# Altium schematic sheet Microcontroller.SchDoc: Microcontroller
size A4; SheetNumber: 4; SheetTotal: 6
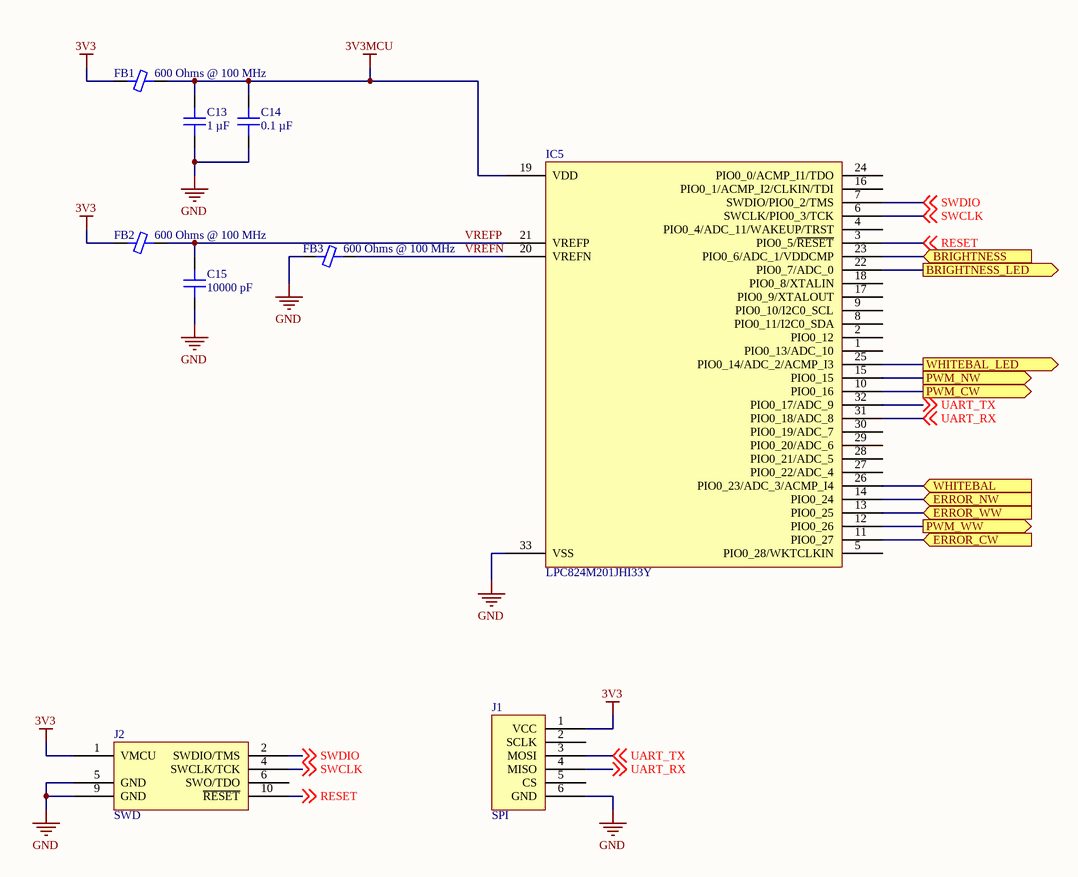
[diagram p0: Microcontroller.SchDoc]

## Parts
C13  1 µF  [CAP 0603_1608]
C14  0.1 µF  [CAP 0603_1608]
C15  10000 pF  [CAP 0603_1608]
FB1  600 Ohms @ 100 MHz  [FER 0603_1608]
FB2  600 Ohms @ 100 MHz  [FER 0603_1608]
FB3  600 Ohms @ 100 MHz  [FER 0603_1608]
IC5  LPC824M201JHI33Y  [NXP HVQFN-33 5X5MM]
J1  SPI  [SPI Breakout]
J2  SWD  [10 Pin SWD]  (no BOM)

## Ports
BRIGHTNESS (in), BRIGHTNESS_LED (out), ERROR_CW (in), ERROR_NW (in), ERROR_WW (in), PWM_CW (out), PWM_NW (out), PWM_WW (out), WHITEBAL (in), WHITEBAL_LED (out)

## Nets
3V3: FB1.1 FB2.1 J1.1(VCC) J2.1(VMCU)
3V3MCU: C13.2 C14.2 FB1.2 IC5.19(VDD)
GND: C13.1 C14.1 C15.1 FB3.1 IC5.33(VSS) J1.6(GND) J2.5(GND) J2.9(GND)
BRIGHTNESS: IC5.23(PIO0_6/ADC_1/VDDCMP) ; port BRIGHTNESS
BRIGHTNESS_LED: IC5.22(PIO0_7/ADC_0) ; port BRIGHTNESS_LED
ERROR_CW: IC5.11(PIO0_27) ; port ERROR_CW
ERROR_NW: IC5.14(PIO0_24) ; port ERROR_NW
ERROR_WW: IC5.13(PIO0_25) ; port ERROR_WW
PWM_CW: IC5.10(PIO0_16) ; port PWM_CW
PWM_NW: IC5.15(PIO0_15) ; port PWM_NW
PWM_WW: IC5.12(PIO0_26) ; port PWM_WW
RESET: IC5.3(PIO0_5/~{RESET}) J2.10(~{RESET}) ; off-sheet RESET
SWCLK: IC5.6(SWCLK/PIO0_3/TCK) J2.4(SWCLK/TCK) ; off-sheet SWCLK
SWDIO: IC5.7(SWDIO/PIO0_2/TMS) J2.2(SWDIO/TMS) ; off-sheet SWDIO
UART_RX: IC5.31(PIO0_18/ADC_8) J1.4(MISO) ; off-sheet UART_RX
UART_TX: IC5.32(PIO0_17/ADC_9) J1.3(MOSI) ; off-sheet UART_TX
VREFN: FB3.2 IC5.20(VREFN)
VREFP: C15.2 FB2.2 IC5.21(VREFP)
WHITEBAL: IC5.26(PIO0_23/ADC_3/ACMP_I4) ; port WHITEBAL
WHITEBAL_LED: IC5.25(PIO0_14/ADC_2/ACMP_I3) ; port WHITEBAL_LED

Not connected (* = marked no-connect by the designer): IC5 1(PIO0_13/ADC_10) 2(PIO0_12) 4(PIO0_4/ADC_11/WAKEUP/TRST) 5(PIO0_28/WKTCLKIN) 8(PIO0_11/I2C0_SDA) 9(PIO0_10/I2C0_SCL) 16(PIO0_1/ACMP_I2/CLKIN/TDI) 17(PIO0_9/XTALOUT) 18(PIO0_8/XTALIN) 24(PIO0_0/ACMP_I1/TDO) 27(PIO0_22/ADC_4) 28(PIO0_21/ADC_5) 29(PIO0_20/ADC_6) 30(PIO0_19/ADC_7); J1 2(SCLK) 5(CS); J2 6(SWO/TDO)

## Notes on the sheet
- Title
- Size:
- Date:
- A4
- Number:
- Time:
- Revision:
- Sheet
- of
- File:

## Library data of the parts
C13 = CC0603KRX7R6BB105: CAP CER 1UF 10V X7R 0603; manufacturer: Yageo; Tolerance: ±10%; Part Number: CC0603KRX7R6BB105; Value: 1 µF; Applications: General Purpose; Capacitance: 1 µF; componentlink1description: Datasheet; componentlink1url: https://www.yageo.com/upload/media/product/productsearch/datasheet/mlcc/UPY-GPHC_X7R_6.3V-to-50V_18.pdf; componentlink2description: DigiKey Link; componentlink2url: https://www.digikey.com/en/products/detail/yageo/CC0603KRX7R6BB105/5195204; Device Package: 0603 (1608 Metric); lastupdated: 16/03/2022 06:22:54; Lifecycle Status: Active; Minimum Order: 1; Mounting Type: Surface Mount, MLCC; Operating Temperature: -55°C ~ 125°C; Package / Case: 0603 (1608 Metric); packaging: TapeAndReel; partid: 2290; Part Status: Active; price: 0.02; series: CC; Size / Dimension: 0.063" L x 0.031" W (1.60mm x 0.80mm); Supplier 1: DigiKey; Supplier Part Number 1: 311-1796-1-ND; Temperature Coefficient: X7R; Thickness (Max): 0.035" (0.90mm); Voltage - Rated: 10V
C14 = CC0603KRX7R6BB104: CAP CER 0.1UF 10V X7R 0603; manufacturer: Yageo; Tolerance: ±10%; Part Number: CC0603KRX7R6BB104; Value: 0.1 µF; Applications: General Purpose; Capacitance: 0.1 µF; componentlink1description: Datasheet; componentlink1url: https://www.yageo.com/upload/media/product/productsearch/datasheet/mlcc/UPY-GPHC_X7R_6.3V-to-50V_18.pdf; componentlink2description: DigiKey Link; componentlink2url: https://www.digikey.com/en/products/detail/yageo/CC0603KRX7R6BB104/5883741; Device Package: 0603 (1608 Metric); lastupdated: 16/03/2022 06:22:39; Lifecycle Status: Active; Minimum Order: 1; Mounting Type: Surface Mount, MLCC; Operating Temperature: -55°C ~ 125°C; Package / Case: 0603 (1608 Metric); packaging: TapeAndReel; partid: 7937; Part Status: Active; price: 0.01; series: CC; Size / Dimension: 0.063" L x 0.031" W (1.60mm x 0.80mm); Supplier 1: DigiKey; Supplier Part Number 1: 311-4055-1-ND; Temperature Coefficient: X7R; Thickness (Max): 0.035" (0.90mm); Voltage - Rated: 10V
C15 = CC0603KRX7R6BB103: CAP CER 10000PF 10V X7R 0603; manufacturer: Yageo; Tolerance: ±10%; Part Number: CC0603KRX7R6BB103; Value: 10000 pF; Applications: General Purpose; Capacitance: 10000 pF; componentlink1description: Datasheet; componentlink1url: https://www.yageo.com/upload/media/product/productsearch/datasheet/mlcc/UPY-GPHC_X7R_6.3V-to-50V_18.pdf; componentlink2description: DigiKey Link; componentlink2url: https://www.digikey.com/en/products/detail/yageo/CC0603KRX7R6BB103/5883740; Device Package: 0603 (1608 Metric); lastupdated: 16/03/2022 06:22:27; Lifecycle Status: Active; Minimum Order: 1; Mounting Type: Surface Mount, MLCC; Operating Temperature: -55°C ~ 125°C; Package / Case: 0603 (1608 Metric); packaging: TapeAndReel; partid: 11852; Part Status: Active; price: 0.01; series: CC; Size / Dimension: 0.063" L x 0.031" W (1.60mm x 0.80mm); Supplier 1: DigiKey; Supplier Part Number 1: 311-4054-1-ND; Temperature Coefficient: X7R; Thickness (Max): 0.035" (0.90mm); Voltage - Rated: 10V
FB1-FB3 = 2506036017Y2: MULTI-LAYER CHIP BEAD; Manufacturer: Fair-Rite Products Corp.; Current Rating (Max): 2A; DC Resistance (DCR) (Max): 120mOhm; Filter Type: Signal Line; Number of Lines: 1; Part Number: 2506036017Y2; ComponentLink1Description: Datasheet; ComponentLink1URL: https://www.fair-rite.com/wp-content/themes/fair-rite/print_product.php?pid=29757; ComponentLink2Description: DigiKey Link; ComponentLink2URL: https://www.digikey.com/en/products/detail/fair-rite-products-corp/2506036017Y2/14635285; Device Package: 0603 (1608 Metric); Height (Max): 0.037" (0.95mm); Impedance @ Frequency: 600 Ohms @ 100 MHz; LastUpdated: 21/03/2022 18:53:23; Lifecycle Status: Active; Minimum Order: 1; Mounting Type: Surface Mount; Operating Temperature: -55°C ~ 125°C; Package / Case: 0603 (1608 Metric); Packaging: TapeAndReel; PartId: 2657; Part Status: Active; Price: 0.03; Series: -; Size / Dimension: 0.063" L x 0.031" W (1.60mm x 0.80mm); Supplier 1: DigiKey; Supplier Part Number 1: 1934-2506036017Y2CT-ND; Value: 600 Ohms @ 100 MHz
IC5 = LPC824M201JHI33Y: IC MCU 32BIT 32KB FLASH 32HVQFN; Manufacturer: NXP USA Inc.; Connectivity: I²C, SPI, UART/USART; Core Processor: ARM® Cortex®-M0+; Core Size: 32-Bit; Data Converters: A/D 12x12b; Number of I/O: 29; Oscillator Type: Internal; Peripherals: Brown-out Detect/Reset, DMA, POR, PWM, WDT; Program Memory Size: 32KB (32K x 8); RAM Size: 8K x 8; Speed: 30MHz; Voltage - Supply (Vcc/Vdd): 1.8V ~ 3.6V; Part Number: LPC824M201JHI33Y; ComponentLink1Description: Datasheet; ComponentLink1URL: https://www.nxp.com/docs/en/data-sheet/LPC82X.pdf; ComponentLink2Description: DigiKey Link; ComponentLink2URL: //digikey.com/product-detail/en/nxp-usa-inc/LPC824M201JHI33Y/568-13786-2-ND/5170008; Device Package: 32-VFQFN Exposed Pad; LastUpdated: 03/12/2019 17:42:55; Lifecycle Status: 0; Minimum Order: 1; Mounting Type: Surface Mount; Operating Temperature: -40°C ~ 105°C (TA); Package / Case: 32-VFQFN Exposed Pad; Packaging: TapeAndReel; PartId: 38; Part Status: Active; Price: 0.85; Program Memory Type: FLASH; Series: LPC82x; Supplier 1: DigiKey; Supplier Part Number 1: 568-13786-2-ND; Supplier Device Package: 32-HVQFN (5x5)